# Altium schematic sheet 08_PX4IO_V2.SchDoc
size A4
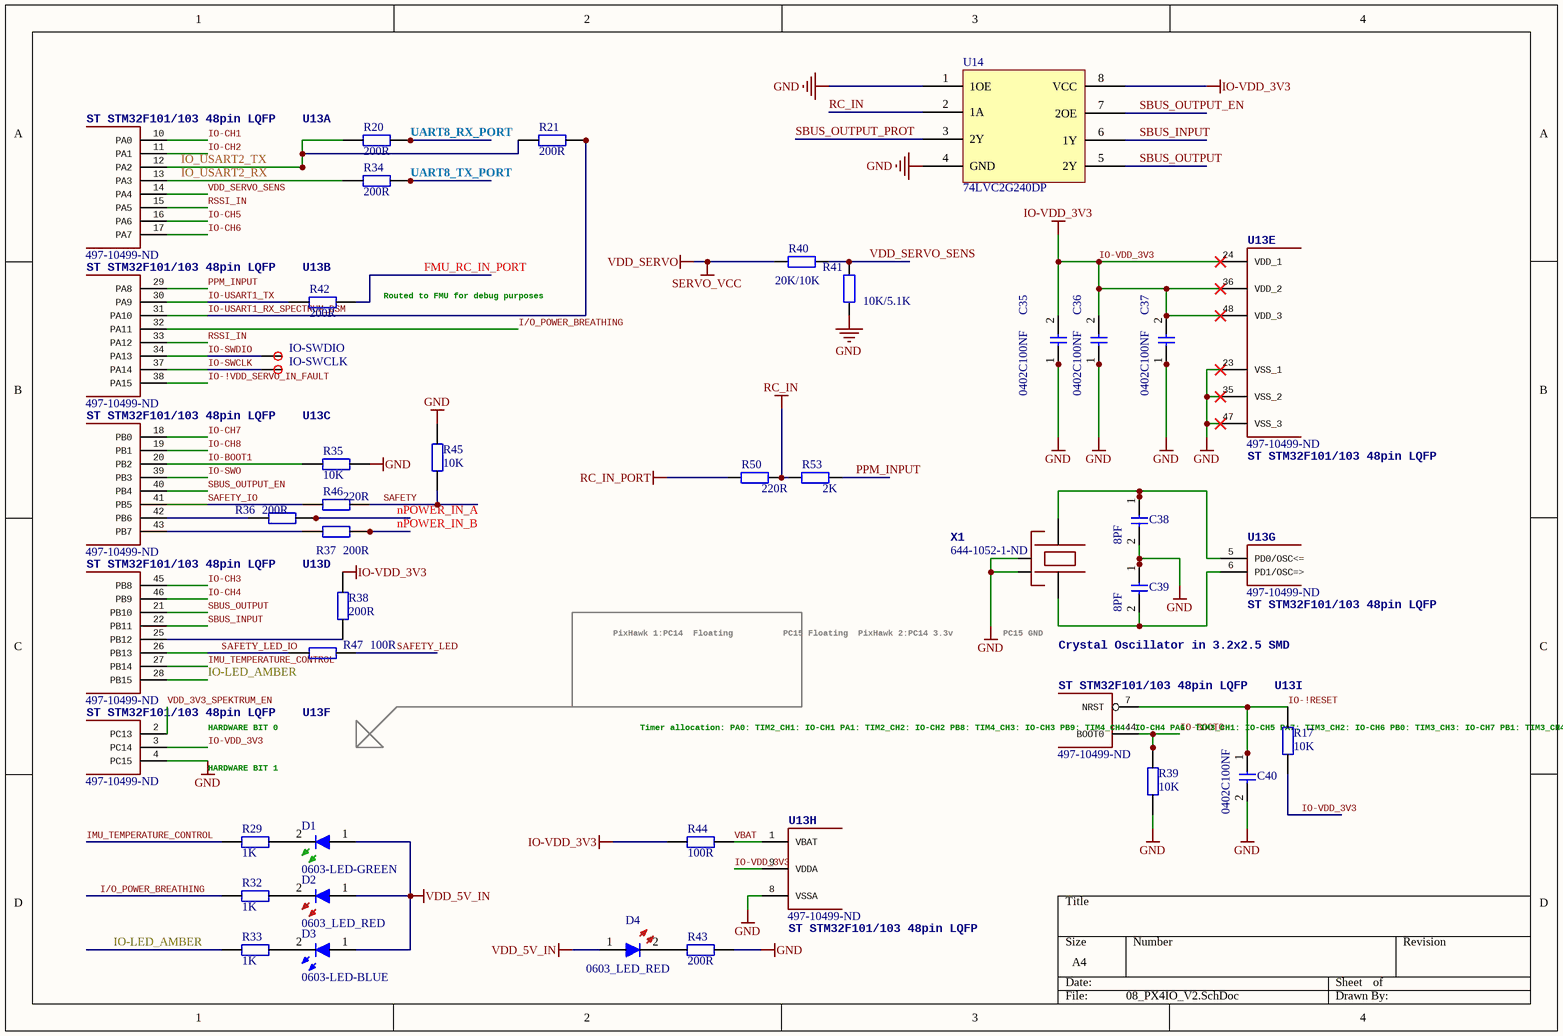
[diagram p0: 08_PX4IO_V2.SchDoc]

## Parts
C35  0402C100NF  [0402C]
C36  0402C100NF  [0402C]
C37  0402C100NF  [0402C]
C38  8PF  [0402C]
C39  8PF  [0402C]
C40  0402C100NF  [0402C]
D1  0603-LED-GREEN  [0603-LED-Green]
D2  0603_LED_RED  [0603-LED-RED]
D3  0603-LED-BLUE  [0603-LED-blue]
D4  0603_LED_RED  [0603-LED-RED]
IO-SWCLK  TP_0.75  [TP0.75]  (value not drawn)
IO-SWDIO  TP_0.75  [TP0.75]  (value not drawn)
R17  10K  [0402R]
R20  200R  [0402R]
R21  200R  [0402R]
R29  1K  [0402R]
R32  1K  [0402R]
R33  1K  [0402R]
R34  200R  [0402R]
R35  10K  [0402R]
R36  200R  [0402R]
R37  200R  [0402R]
R38  200R  [0402R]
R39  10K  [0402R]
R40  20K/10K  [R0402]
R41  10K/5.1K  [R0402]
R42  200R  [0402R]
R43  200R  [0402R]
R44  100R  [0402R]
R45  10K  [0402R]
R46  220R  [0402R]
R47  100R  [0402R]
R50  220R  [R0402]
R53  2K  [R0402]
U13  ST STM32F101/103 48pin LQFP  Supplier Part Number 1: 497-10499-ND  [TQFP48]  (parts A,B,C,D,E,F,G,H,I of 9)
U14  74LVC2G240DP  [TSSOP8]
X1  Crystal Oscillator in 3.2x2.5 SMD  Supplier Part Number 1: 644-1052-1-ND  [3225]

## Nets
GND: C35.1 C36.1 C37.1 C38.2 C39.1 C40.2 R35.2 R39.1 R41.1 R43.2 R45.2 U13.4(PC15) U13.8(VSSA) U13.23(VSS_1) U13.35(VSS_2) U13.47(VSS_3) U14.1(1OE) U14.4(GND) X1.2(NC_2) X1.4(NC_4)
IO-VDD_3V3: C35.2 C36.2 C37.2 R17.2 R38.2 R44.1 U13.3(PC14) U13.9(VDDA) U13.24(VDD_1) U13.36(VDD_2) U13.48(VDD_3) U14.8(VCC)
RC_IN: R50.2 R53.1 U14.2(1A)
RC_IN_PORT: R50.1
SERVO_VCC: R40.1  [also labelled VDD_SERVO]
VDD_5V_IN: D1.1 D2.1 D3.1 D4.1
FMU_RC_IN_PORT: R42.2
I/O_POWER_BREATHING: R32.1 U13.32(PA11)
IMU_TEMPERATURE_CONTROL: R29.1 U13.27(PB14)
IO-!RESET: C40.1 R17.1 U13.7(NRST)
IO-!VDD_SERVO_IN_FAULT: U13.38(PA15)
IO-BOOT0: R39.2 U13.44(BOOT0)
IO-BOOT1: R35.1 U13.20(PB2)
IO-CH1: U13.10(PA0)
IO-CH2: U13.11(PA1)
IO-CH3: U13.45(PB8)
IO-CH4: U13.46(PB9)
IO-CH5: U13.16(PA6)
IO-CH6: U13.17(PA7)
IO-CH7: U13.18(PB0)
IO-CH8: U13.19(PB1)
IO-LED_AMBER: R33.1 U13.28(PB15)
IO-SWCLK: IO-SWCLK.0 U13.37(PA14)
IO-SWDIO: IO-SWDIO.0 U13.34(PA13)
IO-SWO: U13.39(PB3)
IO-USART1_RX_SPECTRUM_DSM: R21.2 U13.31(PA10)
IO-USART1_TX: R42.1 U13.30(PA9)
IO_USART2_RX: R34.1 U13.13(PA3)
IO_USART2_TX: R20.1 R21.1 U13.12(PA2)
nPOWER_IN_A: R36.2
nPOWER_IN_B: R37.2
PPM_INPUT: R53.2 U13.29(PA8)
RSSI_IN: U13.15(PA5) U13.33(PA12)
SAFETY: R45.1 R46.1
SAFETY_IO: R46.2 U13.41(PB5)
SAFETY_LED: R47.1
SAFETY_LED_IO: R47.2 U13.26(PB13)
SBUS_INPUT: U13.22(PB11) U14.6(1Y)
SBUS_OUTPUT: U13.21(PB10) U14.5(2Y)
SBUS_OUTPUT_EN: U13.40(PB4) U14.7(2OE)
SBUS_OUTPUT_PROT: U14.3(2Y)
UART8_RX_PORT: R20.2
UART8_TX_PORT: R34.2
VBAT: R44.2 U13.1(VBAT)
VDD_3V3_SPEKTRUM_EN: U13.2(PC13)
VDD_SERVO_SENS: R40.2 R41.2 U13.14(PA4)
NetC38_1: C38.1 U13.5(PD0/OSC<=) X1.3
NetC39_2: C39.2 U13.6(PD1/OSC=>) X1.1
NetD1_2: D1.2 R29.2
NetD2_2: D2.2 R32.2
NetD3_2: D3.2 R33.2
NetD4_2: D4.2 R43.1
NetR36_1: R36.1 U13.42(PB6)
NetR37_1: R37.1 U13.43(PB7)
NetR38_1: R38.1 U13.25(PB12)

## Notes on the sheet
- (near R42) Routed to FMU for debug purposes
- PixHawk 1:PC14  Floating
  PC15 Floating
  PixHawk 2:PC14 3.3v
  PC15 GND
- HARDWARE BIT 0
- HARDWARE BIT 1
- Timer allocation:
  PA0: TIM2_CH1: IO-CH1
  PA1: TIM2_CH2: IO-CH2
  PB8: TIM4_CH3: IO-CH3
  PB9: TIM4_CH4: IO-CH4
  PA6: TIM3_CH1: IO-CH5
  PA7: TIM3_CH2: IO-CH6
  PB0: TIM3_CH3: IO-CH7
  PB1: TIM3_CH4: IO-CH8
  PA8: TIM1_CH1: PPM_IN
  PA11: TIM1_CH4: RSSI_IN

## Library data of the parts
C35-C40 = 0402C100NF: 50V 5%
IO-SWCLK IO-SWDIO = TP_0.75: TP_0.75MM
R17 R20 R21 R29 R32-R39 R42-R47 = 0402R1K: 0402R1K 1%
R40 R41 R50 R53 = Res2: Resistor; Value: 1K; Published: 8-Jun-2000; LatestRevisionDate: 17-Jul-2002; LatestRevisionNote: Re-released for DXP Platform.; PackageReference: AXIAL-0.4; Publisher: Altium Limited; PackageDescription: Axial Device, Thru-Hole; 2 Leads; 0.4 in Pin Spacing
U13 = STM32F10XCXT6: MCU 32BIT ARM 64K FLASH 48LQFP; 3DR_PARTNO: EMC0842; Supplier 1: Digi-Key
U14 = 74LVC2G240
X1 = OSCILLATOR-3.2X2.5: CRYSTAL 24MHZ 8PF SMD; 3DR_PARTNO: ECM0708; PARTNO: NX3225SA-24.000MHZ-STD-CSR-1; Supplier 1: Digi-Key; Value: 24MHz